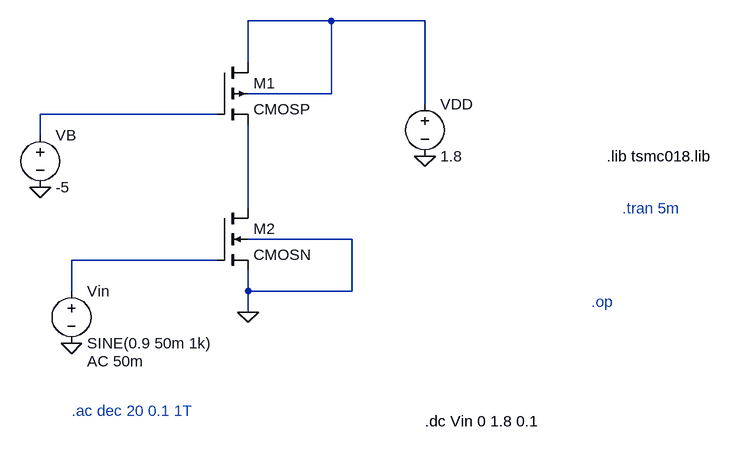
[diagram p0: schematic expt_1_b.asc]
expt_1_b.asc, the LTspice schematic file:
Version 4.1
SHEET 1 972 680
WIRE 368 32 240 32
WIRE 512 32 368 32
WIRE 240 96 240 32
WIRE 368 144 368 32
WIRE 368 144 240 144
WIRE 512 160 512 32
WIRE 192 176 -80 176
WIRE -80 208 -80 176
WIRE 240 320 240 192
WIRE 400 368 240 368
WIRE 192 400 -32 400
WIRE -32 448 -32 400
WIRE 240 448 240 416
WIRE 400 448 400 368
WIRE 400 448 240 448
WIRE 240 480 240 448
FLAG -32 528 0
FLAG 512 240 0
FLAG -80 288 0
FLAG 240 480 0
SYMBOL pmos4 192 96 R0
SYMATTR InstName M1
SYMATTR Value CMOSP
SYMATTR Value2 l=180n w=0.2u
SYMBOL nmos4 192 320 R0
SYMATTR InstName M2
SYMATTR Value CMOSN
SYMATTR Value2 l=700n w=697.5n
SYMBOL voltage 512 144 R0
WINDOW 123 0 0 Left 0
WINDOW 39 0 0 Left 0
SYMATTR InstName VDD
SYMATTR Value 1.8
SYMBOL voltage -32 432 R0
WINDOW 123 24 124 Left 2
WINDOW 39 0 0 Left 0
SYMATTR Value2 AC 50m
SYMATTR InstName Vin
SYMATTR Value SINE(0.9 50m 1k)
SYMBOL voltage -80 192 R0
WINDOW 123 0 0 Left 0
WINDOW 39 0 0 Left 0
SYMATTR InstName VB
SYMATTR Value -5
TEXT 792 240 Left 2 !.lib tsmc018.lib
TEXT 768 464 Left 2 ;.op
TEXT 816 320 Left 2 ;.tran 5m
TEXT -32 632 Left 2 ;.ac dec 20 0.1 1T
TEXT 512 648 Left 2 !.dc Vin 0 1.8 0.1

The netlist it stands for:
* expt_1_b.asc
M1 N001 N002 N003 N001 CMOSP l=180n w=0.2u
M2 N003 N004 0 0 CMOSN l=700n w=697.5n
VDD N001 0 1.8
Vin N004 0 SINE(0.9 50m 1k) AC 50m
VB N002 0 -5
.model NMOS NMOS
.model PMOS PMOS
.lib standard.mos
.lib tsmc018.lib
* .op
* .tran 5m
* .ac dec 20 0.1 1T
.dc Vin 0 1.8 0.1
.backanno
.end